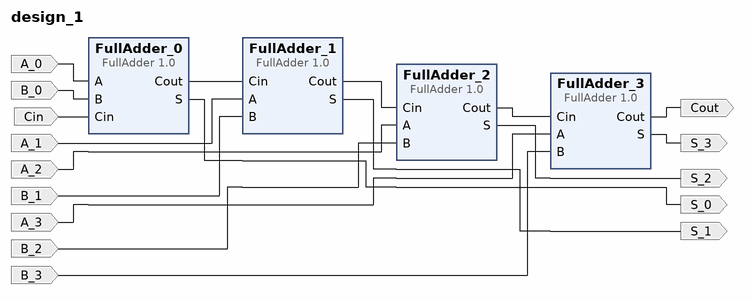
[diagram p0: block diagram of the top level]
# Vivado block design design_1, xc7a100tcsg324-1, Vivado 2022.2
create_bd_design design_1

create_bd_port -dir I A_0
create_bd_port -dir I A_1
create_bd_port -dir I A_2
create_bd_port -dir I A_3
create_bd_port -dir I B_0
create_bd_port -dir I B_1
create_bd_port -dir I B_2
create_bd_port -dir I B_3
create_bd_port -dir I Cin
create_bd_port -dir O S_0
create_bd_port -dir O S_1
create_bd_port -dir O S_2
create_bd_port -dir O S_3
create_bd_port -dir O Cout

create_bd_cell -type ip -vlnv xilinx.com:user:FullAdder:1.0 FullAdder_0
create_bd_cell -type ip -vlnv xilinx.com:user:FullAdder:1.0 FullAdder_1
create_bd_cell -type ip -vlnv xilinx.com:user:FullAdder:1.0 FullAdder_2
create_bd_cell -type ip -vlnv xilinx.com:user:FullAdder:1.0 FullAdder_3

# ---- connections ----

connect_bd_net -net A_0_1 [get_bd_ports A_0] [get_bd_pins FullAdder_0/A]
connect_bd_net -net A_1_1 [get_bd_ports A_1] [get_bd_pins FullAdder_1/A]
connect_bd_net -net A_2_1 [get_bd_ports A_2] [get_bd_pins FullAdder_2/A]
connect_bd_net -net A_3_1 [get_bd_ports A_3] [get_bd_pins FullAdder_3/A]
connect_bd_net -net B_0_1 [get_bd_ports B_0] [get_bd_pins FullAdder_0/B]
connect_bd_net -net B_1_1 [get_bd_ports B_1] [get_bd_pins FullAdder_1/B]
connect_bd_net -net B_2_1 [get_bd_ports B_2] [get_bd_pins FullAdder_2/B]
connect_bd_net -net B_3_1 [get_bd_ports B_3] [get_bd_pins FullAdder_3/B]
connect_bd_net -net Cin_0_1 [get_bd_ports Cin] [get_bd_pins FullAdder_0/Cin]
connect_bd_net [get_bd_pins FullAdder_0/Cout] [get_bd_pins FullAdder_1/Cin]
connect_bd_net [get_bd_pins FullAdder_0/S] [get_bd_ports S_0]
connect_bd_net [get_bd_pins FullAdder_1/Cout] [get_bd_pins FullAdder_2/Cin]
connect_bd_net [get_bd_pins FullAdder_1/S] [get_bd_ports S_1]
connect_bd_net [get_bd_pins FullAdder_2/Cout] [get_bd_pins FullAdder_3/Cin]
connect_bd_net [get_bd_pins FullAdder_2/S] [get_bd_ports S_2]
connect_bd_net [get_bd_pins FullAdder_3/Cout] [get_bd_ports Cout]
connect_bd_net [get_bd_pins FullAdder_3/S] [get_bd_ports S_3]

validate_bd_design
save_bd_design
